# Altium schematic sheet STC15_U1.SchDoc
size A4; DocumentNumber: 3; SheetNumber: 2; SheetTotal: 3
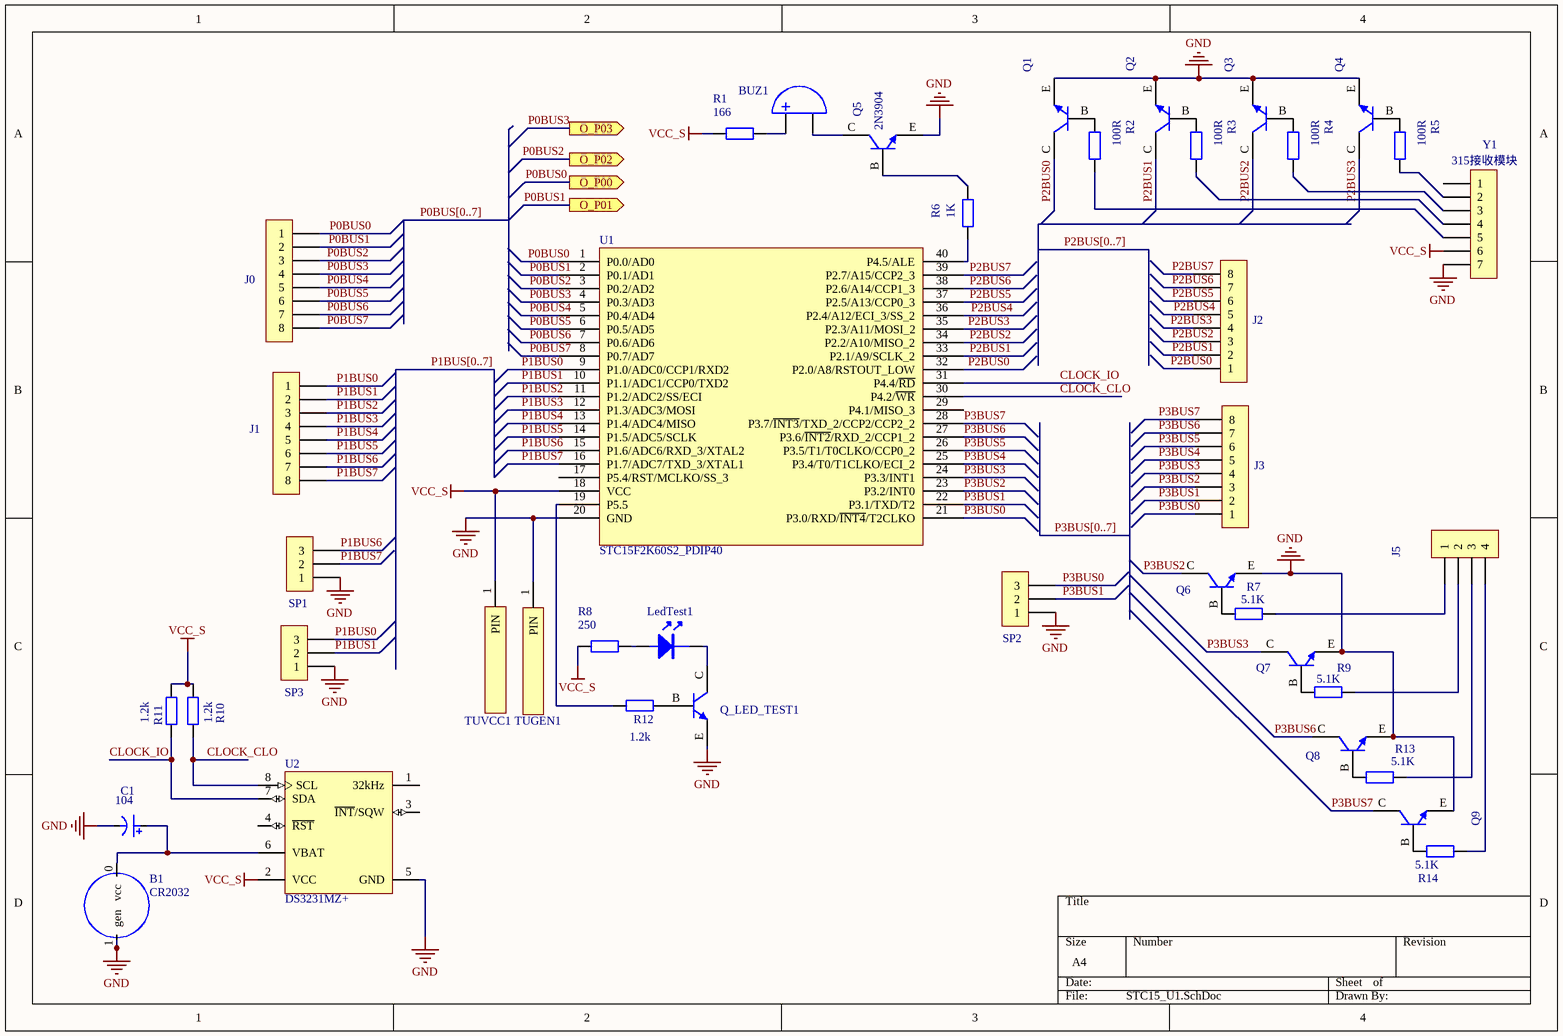
[diagram p0: STC15_U1.SchDoc]

## Parts
B1  CR2032  [CR2032座]
BUZ1  SD1209T5-A1  [BUZ5-12-0R5-9MM]  (value not drawn)
C1  104  [CE5-6R5X5-1mm]
J0  W7810811120AB  [XH8P-2R54-TH]  (value not drawn)
J1  W7810811120AB  [XH8P-2R54-TH]  (value not drawn)
J2  W7810811120AB  [XH8P-2R54-TH]  (value not drawn)
J3  W7810811120AB  [XH8P-2R54-TH]  (value not drawn)
J5  W7810411120AB  [XH4P-2R54-TH]  (value not drawn)
LedTest1  333-2SUBD/S400-A4  [LED2-D5X5]  (value not drawn)
Q1  2N3904  [TO-92-3-EBC]  (value not drawn)
Q2  2N3904  [TO-92-3-EBC]  (value not drawn)
Q3  2N3904  [TO-92-3-EBC]  (value not drawn)
Q4  2N3904  [TO-92-3-EBC]  (value not drawn)
Q5  2N3904  [TO-92-3-EBC]
Q6  2N3904  [TO-92-3-EBC]  (value not drawn)
Q7  2N3904  [TO-92-3-EBC]  (value not drawn)
Q8  2N3904  [TO-92-3-EBC]  (value not drawn)
Q9  2N3904  [TO-92-3-EBC]  (value not drawn)
Q_LED_TEST1  2N3904  [TO-92-3-EBC]  (value not drawn)
R1  166  [RY0R25W]
R2  100R  [RY0R25W]
R3  100R  [RY0R25W]
R4  100R  [RY0R25W]
R5  100R  [RY0R25W]
R6  1K  [RY0R25W]
R7  5.1K  [RY0R25W]
R8  250  [RY0R25W]
R9  5.1K  [RY0R25W]
R10  1.2k  [RY0R25W]
R11  1.2k  [RY0R25W]
R12  1.2k  [RY0R25W]
R13  5.1K  [RY0R25W]
R14  5.1K  [RY0R25W]
SP1  (no value)  [XH3P-2R54-TH]
SP2  (no value)  [XH3P-2R54-TH]
SP3  (no value)  [XH3P-2R54-TH]
TUGEN1  T？  [铺铜条]  (value not drawn)
TUVCC1  T？  [铺铜条]  (value not drawn)
U1  STC15F2K60S2_PDIP40  [DIP40]
U2  DS3231MZ+  [S8MK+1_L]
Y1  315接收模块  [CON7P-2R54-TH]

## Ports
O_P00 (out), O_P01 (out), O_P02 (out), O_P03 (out)

## Nets
GND: B1.1(gen) C1.2 Q1.E Q2.E Q3.E Q4.E Q5.E Q6.E Q7.E Q8.E Q9.E Q_LED_TEST1.E SP1.1 SP2.1 SP3.1 TUGEN1.1(PIN) U1.20(GND) U2.5(GND) Y1.7
VCC_S: R1.1 R8.1 R10.1 R11.1 TUVCC1.1(PIN) U1.18(VCC) U2.2(VCC) Y1.6
CLOCK_CLO: R10.2 U1.30(P4.2/~{WR}) U2.8(SCL)
CLOCK_IO: R11.2 U1.31(P4.4/~{RD}) U2.7(SDA)
P0BUS0: J0.1 U1.1(P0.0/AD0) ; port O_P00
P0BUS1: J0.2 U1.2(P0.1/AD1) ; port O_P01
P0BUS2: J0.3 U1.3(P0.2/AD2) ; port O_P02
P0BUS3: J0.4 U1.4(P0.3/AD3) ; port O_P03
P0BUS4: J0.5 U1.5(P0.4/AD4)
P0BUS5: J0.6 U1.6(P0.5/AD5)
P0BUS6: J0.7 U1.7(P0.6/AD6)
P0BUS7: J0.8 U1.8(P0.7/AD7)
P1BUS0: J1.1 SP3.3 U1.9(P1.0/ADC0/CCP1/RXD2)
P1BUS1: J1.2 SP3.2 U1.10(P1.1/ADC1/CCP0/TXD2)
P1BUS2: J1.3 U1.11(P1.2/ADC2/SS/ECI)
P1BUS3: J1.4 U1.12(P1.3/ADC3/MOSI)
P1BUS4: J1.5 U1.13(P1.4/ADC4/MISO)
P1BUS5: J1.6 U1.14(P1.5/ADC5/SCLK)
P1BUS6: J1.7 SP1.3 U1.15(P1.6/ADC6/RXD_3/XTAL2)
P1BUS7: J1.8 SP1.2 U1.16(P1.7/ADC7/TXD_3/XTAL1)
P2BUS0: J2.1 Q1.C U1.32(P2.0/A8/RSTOUT_LOW)
P2BUS1: J2.2 Q2.C U1.33(P2.1/A9/SCLK_2)
P2BUS2: J2.3 Q3.C U1.34(P2.2/A10/MISO_2)
P2BUS3: J2.4 Q4.C U1.35(P2.3/A11/MOSI_2)
P2BUS4: J2.5 U1.36(P2.4/A12/ECI_3/SS_2)
P2BUS5: J2.6 U1.37(P2.5/A13/CCP0_3)
P2BUS6: J2.7 U1.38(P2.6/A14/CCP1_3)
P2BUS7: J2.8 U1.39(P2.7/A15/CCP2_3)
P3BUS0: J3.1 SP2.3 U1.21(P3.0/RXD/~{INT4}/T2CLKO)
P3BUS1: J3.2 SP2.2 U1.22(P3.1/TXD/T2)
P3BUS2: J3.3 Q6.C U1.23(P3.2/INT0)
P3BUS3: J3.4 Q7.C U1.24(P3.3/INT1)
P3BUS4: J3.5 U1.25(P3.4/T0/T1CLKO/ECI_2)
P3BUS5: J3.6 U1.26(P3.5/T1/T0CLKO/CCP0_2)
P3BUS6: J3.7 Q8.C U1.27(P3.6/~{INT2}/RXD_2/CCP1_2)
P3BUS7: J3.8 Q9.C U1.28(P3.7/~{INT3}/TXD_2/CCP2/CCP2_2)
NetB1_0: B1.0(vcc) C1.1 U2.6(VBAT)
NetBUZ1_1: BUZ1.1 R1.2
NetBUZ1_2: BUZ1.2 Q5.C
NetJ5_1: J5.1 R7.2
NetJ5_2: J5.2 R9.2
NetJ5_3: J5.3 R13.2
NetJ5_4: J5.4 R14.2
NetLedTest1_1: LedTest1.1 R8.2
NetLedTest1_2: LedTest1.2 Q_LED_TEST1.C
NetQ1_B: Q1.B R2.1
NetQ2_B: Q2.B R3.1
NetQ3_B: Q3.B R4.1
NetQ4_B: Q4.B R5.1
NetQ5_B: Q5.B R6.2
NetQ6_B: Q6.B R7.1
NetQ7_B: Q7.B R9.1
NetQ8_B: Q8.B R13.1
NetQ9_B: Q9.B R14.1
NetQ_LED_TEST1_B: Q_LED_TEST1.B R12.2
NetR2_2: R2.2 Y1.5
NetR3_2: R3.2 Y1.4
NetR4_2: R4.2 Y1.3
NetR5_2: R5.2 Y1.2
NetR6_1: R6.1 U1.40(P4.5/ALE)
NetR12_1: R12.1 U1.19(P5.5)

Not connected (* = marked no-connect by the designer): U1 17(P5.4/RST/MCLKO/SS_3) 29(P4.1/MISO_3); U2 1(32kHz) 3(~{INT}/SQW) 4(~{RST}); Y1 1

## Buses and harness runs
bus P0BUS[0..7]
bus P1BUS[0..7]
bus P2BUS[0..7]
bus P3BUS[0..7]

## Library data of the parts
BUZ1 = 102BA-00004OD.01: DIP,12x9mm,额定电压DC5V,频率2048Hz,黑色,间距5mm; Allow Altenative Part: Y; serial number: 4; Categories: 蜂鸣器; COMPONENTLINK 1 DESCRIPTION: GetDatasheet; Remark: Verified by BU1（黄雄青） check list V1.0; Modify time: 2016年05月12号; Approved: YES; Part Number: 102BA-00004OD.01; Category: 有源蜂鸣器; Value: SD1209T5-A1; PACKAGE: tray; Mounting Type: ThroughHole; Size: 12x9mm; Supplier 1: TDK; Supplier Part Number 1: SD1209T5-A1; Pricing 1: 6.73; COMPONENTLINK 1 URL: https://product.tdk.com/info/en/catalog/datasheets/ec211_sd.pdf; MOQ: 5000
C1 = 102CB-00002OD.01: DIP,电容量681pf,额定电压2000V,偏差±10%,6.5X5mm; Allow Altenative Part: Y; serial number: 14; Categories: 电容; Value: 681pF; Tolerance: ±10%; Rated Voltage: 2000V; COMPONENTLINK 1 DESCRIPTION: ShowDatasheet; Remark: Verified by BU1（黄雄青） check list V1.0; Modify time: 2015年11月05号; Approved: YES; Part Number: 102CB-00002OD.01; Category: 陶瓷电容; Operating Temperature: -25°C~105°C; PACKAGE: Bulk; Mounting Type: ThroughHole; Applications: Automotive; Size: 6.5; Max Thickness: 5; Supplier 1: TDK; Supplier Part Number 1: CK45-B3DD681KYLR; Pricing 1: 0.7242; COMPONENTLINK 1 URL: http://pdf-file.ic37.com/pdf6/TDK/CK45-B3DD222KYNA_datasheet_1118532/182787/CK45-B_datasheet.pdf; MOQ: 1000
J0-J3 = 102NB-00026CY.01: DIP,座子,封装脚距2.54mm,180度,1x8PIN,塑高/针长7.0/3.40mm,白色; Allow Altenative Part: Y; serial number: 280; Categories: 连接器; COMPONENTLINK 1 DESCRIPTION: GetDatasheet; Remark: Verified by CRD（赖程奇） check list V1.0; Modify time: 2016年08月22号; Approved: YES; Part Number: 102NB-00026CY.01; Category: XH连接器; Value: W7810811120AB; PACKAGE: Bulk; Mounting Type: ThroughHole; Supplier 1: 富盈源; Supplier Part Number 1: W7810811120AB; Pricing 1: .03; COMPONENTLINK 1 URL: http://www.fyconn.com/productView.asp?id=445; MOQ: 500
J5 = 102NB-00025CY.01: DIP,座子,封装脚距2.54mm,180度,1x4PIN,塑高/针长7.0/3.40mm,白色; Allow Altenative Part: Y; serial number: 276; Categories: 连接器; COMPONENTLINK 1 DESCRIPTION: GetDatasheet; Remark: Verified by CRD（赖程奇） check list V1.0; Modify time: 2016年05月12号; Approved: YES; Part Number: 102NB-00025CY.01; Category: XH连接器; Value: W7810411120AB; PACKAGE: Bulk; Mounting Type: ThroughHole; Supplier 1: 富盈源; Supplier Part Number 1: W7810411120AB; Pricing 1: 3.8; COMPONENTLINK 1 URL: http://www.fyconn.com/productView.asp?id=340; MOQ: 500
LedTest1 = 102DL-00029CH.01: DIP,封装/间距直径5/2.54mm,额定电压3.3V,亮度高亮,蓝色; Allow Altenative Part: Y; serial number: 36; Categories: 二极管; Rated Voltage: 3.3V; COMPONENTLINK 1 DESCRIPTION: OpenDatasheet; Remark: Verified by CRD（张宗良） check list V1.0; Modify time: 2017年01月07号; Approved: YES; Part Number: 102DL-00029CH.01; Category: 发光二极管; Value: 333-2SUBD/S400-A4; Other: 蓝色; PACKAGE: Bulk; Mounting Type: ThroughHole; Supplier 1: 台湾亿光; Supplier Part Number 1: 333-2SUBD/S400-A4; COMPONENTLINK 1 URL: http://www.everlight.com/file/ProductFile/333-2SUBD-S400-A4.pdf
Q1-Q9 Q_LED_TEST1 = 102GN-00009BA.01: DIP,封装形式TO-92-3,耐压值40V,额定电流200mA,耗散功率625mW; Allow Altenative Part: Y; serial number: 1; Categories: 三极管; Rated Power: 625mW; Rated Voltage: 40V; Rated Current: 0.2A; COMPONENTLINK 1 DESCRIPTION: OpenDatasheet; Remark: Verified by BU1（吴明徽）check list V1.0; Modify time: 2015年08月08号; Approved: YES; Part Number: 102GN-00009BA.01; Category: NPN三极管; Value: 2N3904; PACKAGE: Tape&Reel; Mounting Type: SurfaceMount; Size: TO-92-3; Supplier 1: ON; Supplier Part Number 1: 2N3904; Pricing 1: .17; COMPONENTLINK 1 URL: http://media.digikey.com/pdf/Data%20Sheets/ON%20Semiconductor%20PDFs/2N3903,%202N3904%20Rev4.pdf; MOQ: 1000
R1 = 102RO-00079BW.01: DIP,阻值1K,精度±5%,9.0x3.3mm,额定功率1/2W; Allow Altenative Part: Y; serial number: 13; Categories: 电阻; Value: 1K; Tolerance: ±5%; Rated Power: 1/2W; COMPONENTLINK 1 DESCRIPTION: OpenDatasheet; Remark: Verified by BU3（吴明徽）check list V1.0; Modify time: 2015年07月10号; Approved: YES; Part Number: 102RO-00079BW.01; Category: 功率电阻; PACKAGE: Bulk; Mounting Type: ThroughHole; Size: 9.0x3.3mm; Supplier 1: YAGEO; Supplier Part Number 1: CFR-50JB-52-1K; Pricing 1: .155; COMPONENTLINK 1 URL: http://www.yageo.com/documents/recent/Yageo%20LR_CFR_2013.pdf; MOQ: 500
R2-R5 = 102RO-00040BS.01: DIP,阻值100R,精度±1%,6.1x2.29mm,额定功率1/4W; Allow Altenative Part: Y; serial number: 15; Categories: 电阻; Tolerance: ±1%; Rated Power: 1/4W; COMPONENTLINK 1 DESCRIPTION: OpenDatasheet; Remark: Verified by BU3（吴明徽）check list V1.0; Modify time: 2015年07月10号; Approved: YES; Part Number: 102RO-00040BS.01; Category: 功率电阻; Value: 100R; PACKAGE: Bulk; Mounting Type: ThroughHole; Size: 2.29x7.37mm; Supplier 1: Vishay; Supplier Part Number 1: CMF55100R00FKRE39; Pricing 1: 1.44; COMPONENTLINK 1 URL: http://www.vishay.com/docs/31027/cmfmil.pdf; MOQ: 5000
R6 = 102RO-00079BW.01: DIP,阻值1K,精度±5%,9.0x3.3mm,额定功率1/2W; Allow Altenative Part: Y; serial number: 13; Categories: 电阻; Tolerance: ±5%; Rated Power: 1/2W; COMPONENTLINK 1 DESCRIPTION: OpenDatasheet; Remark: Verified by BU3（吴明徽）check list V1.0; Modify time: 2015年07月10号; Approved: YES; Part Number: 102RO-00079BW.01; Category: 功率电阻; Value: 1K; PACKAGE: Bulk; Mounting Type: ThroughHole; Size: 9.0x3.3mm; Supplier 1: YAGEO; Supplier Part Number 1: CFR-50JB-52-1K; Pricing 1: .155; COMPONENTLINK 1 URL: http://www.yageo.com/documents/recent/Yageo%20LR_CFR_2013.pdf; MOQ: 500
R7 R9 R13 R14 = 102RO-00048BS.01: DIP,阻值5.1K,精度±1%,6.2x2.29mm,额定功率1/4W; Allow Altenative Part: Y; serial number: 10; Categories: 电阻; Tolerance: ±1%; Rated Power: 1/4W; COMPONENTLINK 1 DESCRIPTION: OpenDatasheet; Remark: Verified by BU3（吴明徽）check list V1.0; Modify time: 2015年07月10号; Approved: YES; Part Number: 102RO-00048BS.01; Category: 功率电阻; Value: 5.1K; PACKAGE: Bulk; Mounting Type: ThroughHole; Size: 2.29x7.5mm; Supplier 1: Vishay; Supplier Part Number 1: CCF555K10FKE36; Pricing 1: 4.48; COMPONENTLINK 1 URL: http://www.vishay.com/docs/31015/ccf55.pdf; MOQ: 5000
R8 R10-R12 = 102RO-00036BS.01: DIP,阻值8.2R,精度±1%,AXIAL0.4,额定功率1/2W; Allow Altenative Part: Y; serial number: 11; Categories: 电阻; Value: 8.2R; Tolerance: ±1%; Rated Power: 1/2W; COMPONENTLINK 1 DESCRIPTION: OpenDatasheet; Remark: Verified by BU3（吴明徽）check list V1.0; Modify time: 2015年07月10号; Approved: YES; Part Number: 102RO-00036BS.01; Category: 功率电阻; PACKAGE: Bulk; Mounting Type: ThroughHole; Size: 2.29x7.5mm; Supplier 1: Vishay; Supplier Part Number 1: CCF558R20FKE36; Pricing 1: 4.48; COMPONENTLINK 1 URL: http://www.vishay.com/docs/31015/ccf55.pdf; MOQ: 5000
SP1-SP3 = 102NB-00017CY.01: DIP,座子,封装脚距2.54mm,180度,1x3PIN,塑高/针长7.0/3.40mm,白色; Allow Altenative Part: Y; serial number: 68; Categories: 连接器; COMPONENTLINK 1 DESCRIPTION: GetDatasheet; Remark: Verified by CRD（赖程奇） check list V1.0; Modify time: 2015年11月06号; Approved: YES; Part Number: 102NB-00017CY.01; Category: XH连接器; PACKAGE: Bulk; Mounting Type: ThroughHole; Supplier 1: 富盈源; Supplier Part Number 1: W7810311120AB; Pricing 1: .35; COMPONENTLINK 1 URL: http://www.fyconn.com/productView.asp?id=445; MOQ: 500
TUGEN1 TUVCC1 = 铺铜条: 2mm*20的铜条用于焊接
U2 = DS3231MZ+: +/-5ppm, MEMS based Real-Time Clock, I2C Interface, 8-Pin SO, -40 to 85 degC, Pb-Free; DatasheetVersion: Rev 3, Dec-2011; PackageVersion: revC, 2010; PackageReference: S8MK+1; PackageDescription: 8-Pin Small-Outline IC, Narrow (0.15in), 1.27 mm Pitch, SOIC (N), Pb-Free; Code_JEDEC: MS-012-AA; Code_IPC: SOIC127P600-8; ComponentLink1Description: Manufacturer URL; ComponentLink1URL: http://www.maxim-ic.com; ComponentLink2Description: Datasheet; ComponentLink2URL: http://datasheets.maxim-ic.com/en/ds/DS3231M.pdf; ComponentLink3Description: Package Specification; ComponentLink3URL: http://pdfserv.maxim-ic.com/package_dwgs/21-0041.PDF
Y1 = 102NL-00032BV.01: DIP,封装脚距2.54mm,180度,1x7PIN,黑色; Allow Altenative Part: Y; serial number: 165; Categories: 连接器; Value: 61300711121; COMPONENTLINK 1 DESCRIPTION: GetDatasheet; Remark: Verified by CRD（赖程奇） check list V1.0; Modify time: 2015年07月10号; Approved: YES; Part Number: 102NL-00032BV.01; Category: 单排针; PACKAGE: Bulk; Mounting Type: ThroughHole; Supplier 1: wurth; Supplier Part Number 1: 61300711121; Pricing 1: 2.05; COMPONENTLINK 1 URL: http://katalog.we-online.de/en/em/620_0xx_111_21/620_032_111_21?m=n&sp=http%3A%2F%2Fwww.we-online.com%2Fweb%2Fen%2Fwuerth_elektronik%2Fsearchpage.php%3Fsearch%3D62003211121; MOQ: 500